# Altium schematic sheet Main.SchDoc: ThunderScope 1000E
size A4; DrawnBy: Aleksa Bjelogrlic; Revision: 1; SheetNumber: 1; SheetTotal: 14
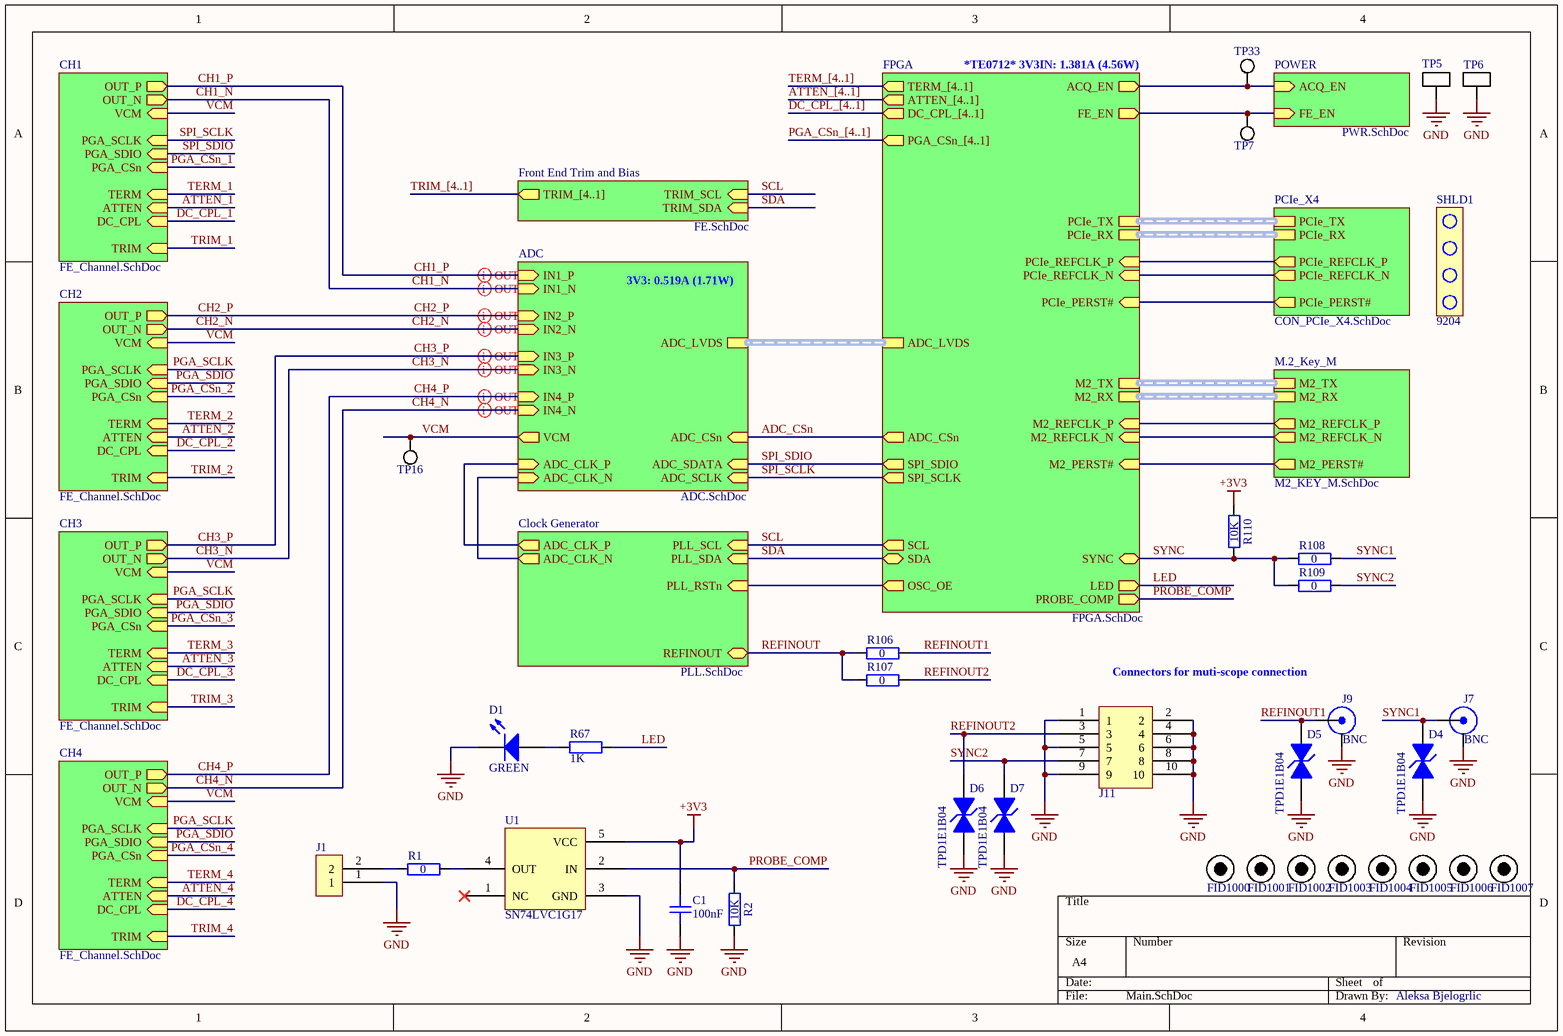
[diagram p0: Main.SchDoc]

## Parts
C1  100nF  [GEN_C_0402]
D1  GREEN  [LED_0603_LTST-S270K]
D4  TPD1E1B04  [TI_X1SON_DPY0002A]
D5  TPD1E1B04  [TI_X1SON_DPY0002A]
D6  TPD1E1B04  [TI_X1SON_DPY0002A]
D7  TPD1E1B04  [TI_X1SON_DPY0002A]
FID1000  PCB  [GEN_FID]  (value not drawn)  (no BOM)
FID1001  PCB  [GEN_FID]  (value not drawn)  (no BOM)
FID1002  PCB  [GEN_FID]  (value not drawn)  (no BOM)
FID1003  PCB  [GEN_FID]  (value not drawn)  (no BOM)
FID1004  PCB  [GEN_FID]  (value not drawn)  (no BOM)
FID1005  PCB  [GEN_FID]  (value not drawn)  (no BOM)
FID1006  PCB  [GEN_FID]  (value not drawn)  (no BOM)
FID1007  PCB  [GEN_FID]  (value not drawn)  (no BOM)
J1  TSW-101-08-F-D-RA  [GEN_2.54mm_1x2_Pin_TH_RA]  (value not drawn)
J7  BNC  [MOL_0731000105]
J9  BNC  [MOL_0731000105]
J11  1.27mm 6 Pin TH  [GEN_1.27mm_2x5_Pin_TH_RA]  (value not drawn)
R1  0  [GEN_R_0402]
R2  10K  [GEN_R_0402]
R67  1K  [GEN_R_0402]
R106  0  [GEN_R_0402]
R107  0  [GEN_R_0402]
R108  0  [GEN_R_0402]
R109  0  [GEN_R_0402]
R110  10K  [GEN_R_0402]
SHLD1  9204  (mechanical)
TP5  5019  [KEY_5019]  (value not drawn)
TP6  5019  [KEY_5019]  (value not drawn)
TP7  PCB  [GEN_TP_PCB]  (value not drawn)  (no BOM)
TP16  PCB  [GEN_TP_PCB]  (value not drawn)  (no BOM)
TP33  PCB  [GEN_TP_PCB]  (value not drawn)  (no BOM)
U1  SN74LVC1G17  [GEN_SC-70-5]

## Sub-sheets
ADC = ADC.SchDoc: IN4_N (in), IN4_P (in), IN3_N (in), IN3_P (in), IN2_N (in), IN2_P (in), VCM (out), IN1_N (in), IN1_P (in), ADC_CSn (in), ADC_SDATA (in), ADC_SCLK (in), ADC_CLK_P (in), ADC_CLK_N (in), ADC_LVDS (harness ADC LVDS)
CH1 = FE_Channel.SchDoc: OUT_P (out), VCM (in), OUT_N (out), TRIM (in), ATTEN (in), DC_CPL (in), PGA_CSn (in), PGA_SCLK (in), PGA_SDIO (in), TERM (in)
CH2 = FE_Channel.SchDoc: OUT_P (out), VCM (in), OUT_N (out), TRIM (in), ATTEN (in), DC_CPL (in), PGA_CSn (in), PGA_SCLK (in), PGA_SDIO (in), TERM (in)
CH3 = FE_Channel.SchDoc: OUT_P (out), VCM (in), OUT_N (out), TRIM (in), ATTEN (in), DC_CPL (in), PGA_CSn (in), PGA_SCLK (in), PGA_SDIO (in), TERM (in)
CH4 = FE_Channel.SchDoc: OUT_P (out), VCM (in), OUT_N (out), TRIM (in), ATTEN (in), DC_CPL (in), PGA_CSn (in), PGA_SCLK (in), PGA_SDIO (in), TERM (in)
Clock Generator = PLL.SchDoc: ADC_CLK_P (out), ADC_CLK_N (out), PLL_RSTn (in), PLL_SDA (in), PLL_SCL (in), REFINOUT (bidir)
FPGA = FPGA.SchDoc: ACQ_EN (out), OSC_OE (out), ADC_CSn (out), SCL (out), SDA (bidir), FE_EN (out), ATTEN_[4..1] (out), DC_CPL_[4..1] (out), SPI_SCLK (out), SPI_SDIO (out), PGA_CSn_[4..1] (out), PCIe_REFCLK_N (in), PCIe_PERST# (in), PCIe_REFCLK_P (in), PCIe_TX (harness PCIe_X4_TX), PCIe_RX (harness PCIe_X4_RX), M2_REFCLK_N (in), M2_PERST# (in), M2_REFCLK_P (in), M2_TX (harness M2_X4_TX), M2_RX (harness M2_X4_RX), TERM_[4..1] (out), SYNC (bidir), ADC_LVDS (harness ADC LVDS), PROBE_COMP (out), LED (out)
Front End Trim and Bias = FE.SchDoc: TRIM_SCL (in), TRIM_SDA (in), TRIM_[4..1] (out)
M.2_Key_M = M2_KEY_M.SchDoc: M2_REFCLK_N (out), M2_PERST# (out), M2_REFCLK_P (out), M2_TX (harness M2_X4_TX), M2_RX (harness M2_X4_RX)
PCIe_X4 = CON_PCIe_X4.SchDoc: PCIe_REFCLK_N (out), PCIe_PERST# (out), PCIe_REFCLK_P (out), PCIe_TX (harness PCIe_X4_TX), PCIe_RX (harness PCIe_X4_RX)
POWER = PWR.SchDoc: FE_EN (in), ACQ_EN (in)

## Nets
+3V3: C1.1 R110.1 U1.5(VCC)
GND: C1.2 D1.1(K) D4.2(A) D5.2(A) D6.2(A) D7.2(A) J1.1 J7.2(SHIELD) J9.2(SHIELD) J11.1 J11.2 J11.4 J11.5 J11.6 J11.8 J11.9 J11.10 R2.1 TP5.1 TP6.1 U1.3(GND)
ADC_CSn: sheet FPGA/ADC_CSn, sheet ADC/ADC_CSn
ATTEN_1: sheet CH1/ATTEN
ATTEN_2: sheet CH2/ATTEN
ATTEN_3: sheet CH3/ATTEN
ATTEN_4: sheet CH4/ATTEN
CH1_N: sheet CH1/OUT_N, sheet ADC/IN1_N
CH1_P: sheet CH1/OUT_P, sheet ADC/IN1_P
CH2_N: sheet ADC/IN2_N, sheet CH2/OUT_N
CH2_P: sheet ADC/IN2_P, sheet CH2/OUT_P
CH3_N: sheet ADC/IN3_N, sheet CH3/OUT_N
CH3_P: sheet ADC/IN3_P, sheet CH3/OUT_P
CH4_N: sheet ADC/IN4_N, sheet CH4/OUT_N
CH4_P: sheet ADC/IN4_P, sheet CH4/OUT_P
DC_CPL_1: sheet CH1/DC_CPL
DC_CPL_2: sheet CH2/DC_CPL
DC_CPL_3: sheet CH3/DC_CPL
DC_CPL_4: sheet CH4/DC_CPL
LED: R67.2 ; sheet FPGA/LED
PGA_CSn_1: sheet CH1/PGA_CSn
PGA_CSn_2: sheet CH2/PGA_CSn
PGA_CSn_3: sheet CH3/PGA_CSn
PGA_CSn_4: sheet CH4/PGA_CSn
PGA_SCLK: sheet CH2/PGA_SCLK, sheet CH3/PGA_SCLK, sheet CH4/PGA_SCLK
PGA_SDIO: sheet CH2/PGA_SDIO, sheet CH3/PGA_SDIO, sheet CH4/PGA_SDIO
PROBE_COMP: R2.2 U1.2(IN) ; sheet FPGA/PROBE_COMP
REFINOUT: R106.2 R107.2 ; sheet Clock Generator/REFINOUT
REFINOUT1: D5.1(K) J9.1(Signal) R106.1
REFINOUT2: D6.1(K) J11.3 R107.1
SCL: sheet Front End Trim and Bias/TRIM_SCL, sheet FPGA/SCL, sheet Clock Generator/PLL_SCL
SDA: sheet Front End Trim and Bias/TRIM_SDA, sheet FPGA/SDA, sheet Clock Generator/PLL_SDA
SPI_SCLK: sheet FPGA/SPI_SCLK, sheet CH1/PGA_SCLK, sheet ADC/ADC_SCLK
SPI_SDIO: sheet FPGA/SPI_SDIO, sheet CH1/PGA_SDIO, sheet ADC/ADC_SDATA
SYNC: R108.2 R109.2 R110.2 ; sheet FPGA/SYNC
SYNC1: D4.1(K) J7.1(Signal) R108.1
SYNC2: D7.1(K) J11.7 R109.1
TERM_1: sheet CH1/TERM
TERM_2: sheet CH2/TERM
TERM_3: sheet CH3/TERM
TERM_4: sheet CH4/TERM
TRIM_1: sheet CH1/TRIM
TRIM_2: sheet CH2/TRIM
TRIM_3: sheet CH3/TRIM
TRIM_4: sheet CH4/TRIM
VCM: TP16.1 ; sheet CH1/VCM, sheet ADC/VCM, sheet CH2/VCM, sheet CH3/VCM, sheet CH4/VCM
NetD1_2: D1.2(A) R67.1
NetJ1_2: J1.2 R1.1
NetR1_2: R1.2 U1.4(OUT)
NetTP7_1: TP7.1 ; sheet FPGA/FE_EN, sheet POWER/FE_EN
NetTP33_1: TP33.1 ; sheet FPGA/ACQ_EN, sheet POWER/ACQ_EN
(unnamed): sheet FPGA/OSC_OE, sheet Clock Generator/PLL_RSTn
(unnamed): sheet FPGA/PCIe_REFCLK_N, sheet PCIe_X4/PCIe_REFCLK_N
(unnamed): sheet FPGA/PCIe_PERST#, sheet PCIe_X4/PCIe_PERST#
(unnamed): sheet FPGA/PCIe_REFCLK_P, sheet PCIe_X4/PCIe_REFCLK_P
(unnamed): sheet FPGA/M2_REFCLK_N, sheet M.2_Key_M/M2_REFCLK_N
(unnamed): sheet FPGA/M2_PERST#, sheet M.2_Key_M/M2_PERST#
(unnamed): sheet FPGA/M2_REFCLK_P, sheet M.2_Key_M/M2_REFCLK_P
(unnamed): sheet ADC/ADC_CLK_P, sheet Clock Generator/ADC_CLK_P
(unnamed): sheet ADC/ADC_CLK_N, sheet Clock Generator/ADC_CLK_N

Not connected (* = marked no-connect by the designer): U1 1(NC)*

## Buses and harness runs
bus ATTEN_[4..1] = sheet FPGA/ATTEN_[4..1]
bus DC_CPL_[4..1] = sheet FPGA/DC_CPL_[4..1]
bus PGA_CSn_[4..1] = sheet FPGA/PGA_CSn_[4..1]
bus TERM_[4..1] = sheet FPGA/TERM_[4..1]
bus TRIM_[4..1] = sheet Front End Trim and Bias/TRIM_[4..1]
harness sheet ADC/ADC_LVDS = sheet FPGA/ADC_LVDS
harness sheet FPGA/M2_RX = sheet M.2_Key_M/M2_RX
harness sheet FPGA/M2_TX = sheet M.2_Key_M/M2_TX
harness sheet FPGA/PCIe_RX = sheet PCIe_X4/PCIe_RX
harness sheet FPGA/PCIe_TX = sheet PCIe_X4/PCIe_TX

## Layout directives
differential pair; differential pair class 100Z_Diff_PGA: CH1_N, CH1_P, CH2_N, CH2_P, CH3_N, CH3_P, CH4_N, CH4_P

## Notes on the sheet
- *TE0712* 3V3IN: 1.381A (4.56W)
- 3V3: 0.519A (1.71W)
- Connectors for muti-scope connection
- Aleksa Bjelogrlic

## Library data of the parts
C1 = CAP 100nF 16V X7R 0402: House Part Number: C-100nF-0402-002; Manufacturer: Murata; Manufacturer Part Number: GCM155R71C104KA55D; Voltage Rating: 16V; Package: 0402; Supplier 1: Mouser; Supplier Part Number 1: 81-GCM155R71C104KA5D; Value: 100nF
D1 = LED GREEN 0603 LTST-S270K: Manufacturer: Vishay Lite-On; Manufacturer Part Number: LTST-S270KGKT; Supplier 1: Mouser; Supplier Part Number 1: 859-LTST-S270KGKT
D4-D7 = TVS TPD1E1B04: Manufacturer: Texas Instruments; Manufacturer Part Number: TPD1E1B04DPYR; Supplier 1: Texas Instruments; Supplier Part Number 1: TPD1E1B04DPYR
FID1000-FID1007 = FID 1mm: House Part Number: Fiducial-1
J1 = CONN 2.54mm 2 Pin TH RA: Manufacturer: Samtec; Supplier 1: Mouser; Supplier Part Number 1: 200-TSW10108FDRA; Manufacturer Part Number: TSW-101-08-F-D-RA
J7 J9 = BNC JACK R/A: Manufacturer: Molex; Manufacturer Part Number: 73100-0105; Supplier 1: Mouser; Supplier Part Number 1: 538-73100-0105
J11 = CONN 1.27mm 2x5 Pin TH RA: Manufacturer: CNC Tech; Manufacturer Part Number: 3220-10-0200-00; Supplier 1: Digi-Key; Supplier Part Number 1: 1175-1628-ND
R1 R106-R109 = RES 0 OHM 1/16W 0402: Manufacturer: Yageo; Manufacturer Part Number: RC0402JR-070RL; Package: 0402; Supplier 1: Mouser; Supplier Part Number 1: 603-RC0402JR-070RL; Value: 0
R2 R110 = RES 10K OHM 1% 1/10W 0402: Manufacturer: Panasonic; Manufacturer Part Number: ERJ-2RKF1002X; Tolerance: 1%; Package: 0402; Supplier 1: Mouser; Supplier Part Number 1: 667-ERJ-2RKF1002X; Value: 10K
R67 = RES 1K OHM 1% 1/10W 0402: House Part Number: R-1K-0402-1%-001; Manufacturer: Yageo; Manufacturer Part Number: RC0402FR-071KL; Tolerance: 1%; Package: 0402; Supplier 1: Mouser; Supplier Part Number 1: 603-RC0402FR-071KL; Value: 1K
SHLD1 = PCIe IO Shield: Manufacturer: Keystone Electronics; Supplier 1: Mouser; Supplier Part Number 1: 534-9204; Manufacturer Part Number: 9204
TP5 TP6 = TP KEYSTONE 5019: Manufacturer: Keystone Electronics; Supplier 1: Mouser; Supplier Part Number 1: 534-5019; Manufacturer Part Number: 5019
TP7 TP16 TP33 = TP PCB 1mm
U1 = IC BUFFER SN74LVC1G17: Manufacturer: Texas Instruments; Manufacturer Part Number: SN74LVC1G17DBVR; Supplier 1: Texas Instruments; Supplier Part Number 1: SN74LVC1G17DBVR